# EAGLE schematic SignControlSchematic_v0 (EAGLE 7.5.0)
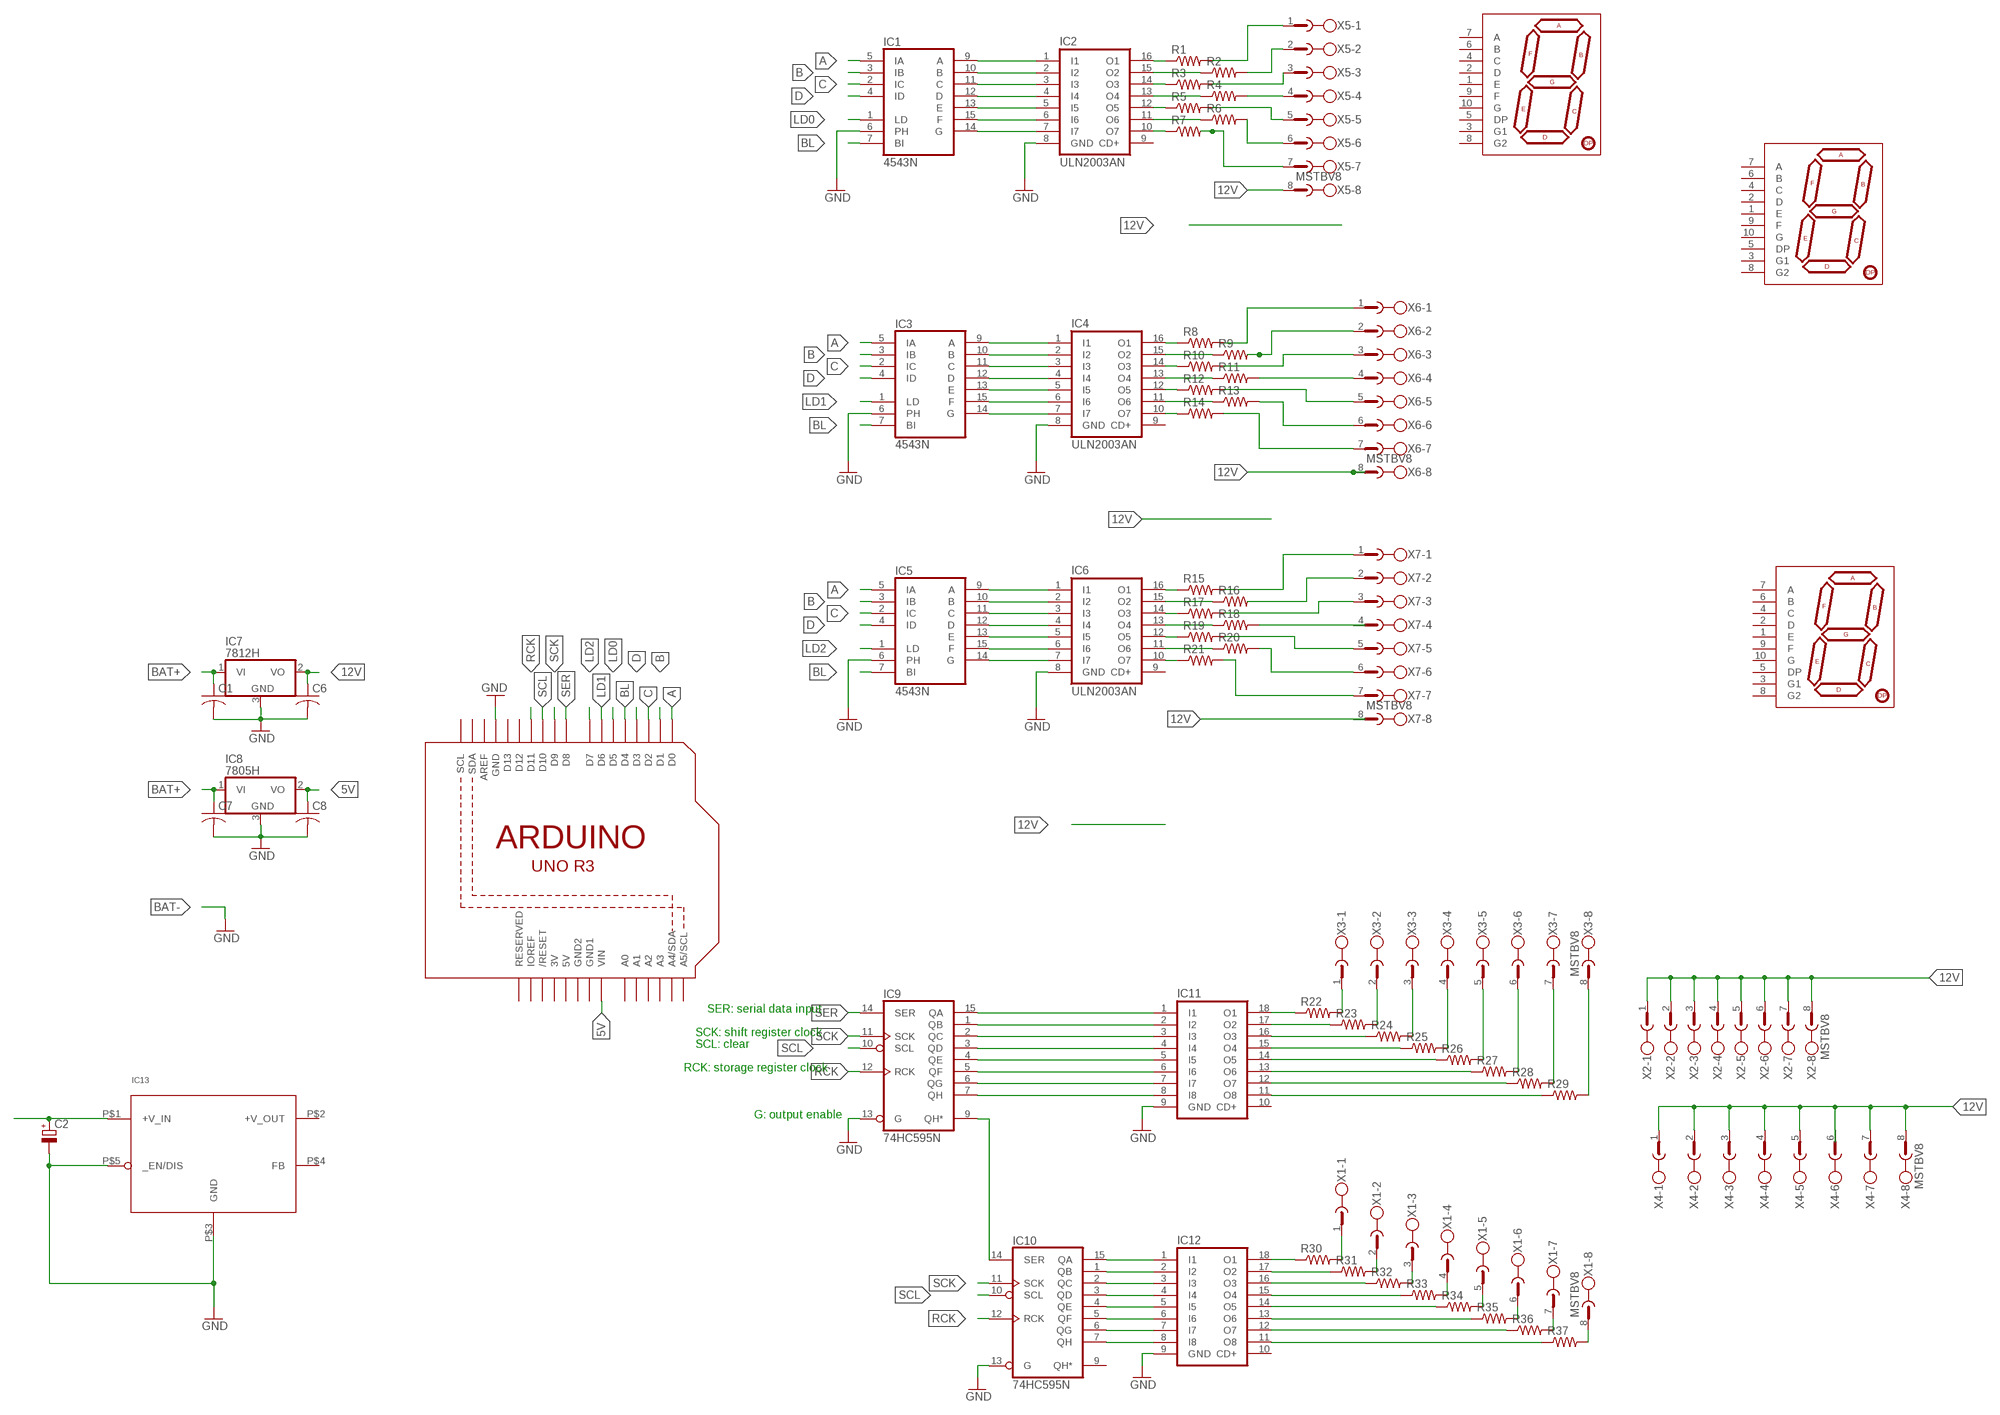
[diagram p0: schematic, sheet 1]

## Parts
C1  C-US025-024X044  [C025-024X044]
C2  CPOL-EUE7.5-16  [E7,5-16]
C6  C-US025-024X044  [C025-024X044]
C7  C-US025-024X044  [C025-024X044]
C8  C-US025-024X044  [C025-024X044]
IC1  4543N  [DIL16]
IC2  ULN2003AN  [DIL16]
IC3  4543N  [DIL16]
IC4  ULN2003AN  [DIL16]
IC5  4543N  [DIL16]
IC6  ULN2003AN  [DIL16]
IC7  7812H  [TO39]
IC8  7805H  [TO39]
IC9  74HC595N  [DIL16]
IC10  74HC595N  [DIL16]
IC11  ULN2803A  [DIL18]
IC12  ULN2803A  [DIL18]
IC13  LM2576-T05A  [TO-220-5_IN-LINE]
R1  R-US_0204/2V  [0204V]
R2  R-US_0204/2V  [0204V]
R3  R-US_0204/2V  [0204V]
R4  R-US_0204/2V  [0204V]
R5  R-US_0204/2V  [0204V]
R6  R-US_0204/2V  [0204V]
R7  R-US_0204/2V  [0204V]
R8  R-US_0204/2V  [0204V]
R9  R-US_0204/2V  [0204V]
R10  R-US_0204/2V  [0204V]
R11  R-US_0204/2V  [0204V]
R12  R-US_0204/2V  [0204V]
R13  R-US_0204/2V  [0204V]
R14  R-US_0204/2V  [0204V]
R15  R-US_0204/2V  [0204V]
R16  R-US_0204/2V  [0204V]
R17  R-US_0204/2V  [0204V]
R18  R-US_0204/2V  [0204V]
R19  R-US_0204/2V  [0204V]
R20  R-US_0204/2V  [0204V]
R21  R-US_0204/2V  [0204V]
R22  R-US_0204/2V  [0204V]
R23  R-US_0204/2V  [0204V]
R24  R-US_0204/2V  [0204V]
R25  R-US_0204/2V  [0204V]
R26  R-US_0204/2V  [0204V]
R27  R-US_0204/2V  [0204V]
R28  R-US_0204/2V  [0204V]
R29  R-US_0204/2V  [0204V]
R30  R-US_0204/2V  [0204V]
R31  R-US_0204/2V  [0204V]
R32  R-US_0204/2V  [0204V]
R33  R-US_0204/2V  [0204V]
R34  R-US_0204/2V  [0204V]
R35  R-US_0204/2V  [0204V]
R36  R-US_0204/2V  [0204V]
R37  R-US_0204/2V  [0204V]
U1  ARDUINOR3-BPLACE  [ARDUINOR3-BPLACE]
U$1  7-SEGMENT-DISPLAY-1"-RED  [7-SEGMENT-1"PTH]
U$2  7-SEGMENT-DISPLAY-1"-RED  [7-SEGMENT-1"PTH]
U$3  7-SEGMENT-DISPLAY-1"-RED  [7-SEGMENT-1"PTH]
X1  MSTBV8  [MSTBV8]
X2  MSTBV8  [MSTBV8]
X3  MSTBV8  [MSTBV8]
X4  MSTBV8  [MSTBV8]
X5  MSTBV8  [MSTBV8]
X6  MSTBV8  [MSTBV8]
X7  MSTBV8  [MSTBV8]

## Nets
5V: C8.1 IC8.2(VO) U1.VIN
12V: C6.1 IC7.2(VO) X2.1 X2.2 X2.3 X2.4 X2.5 X2.6 X2.7 X2.8 X4.1 X4.2 X4.3 X4.4 X4.5 X4.7 X4.8 X5.8 X6.8
A: IC1.5(IA) IC3.5(IA) IC5.5(IA) U1.D0
B: IC1.3(IB) IC3.3(IB) IC5.3(IB) U1.D1
BAT+: C1.1 C7.1 IC7.1(VI) IC8.1(VI)
BL: IC1.7(BI) IC3.7(BI) IC5.7(BI) U1.D4
C: IC1.2(IC) IC3.2(IC) IC5.2(IC) U1.D2
D: IC1.4(ID) IC3.4(ID) IC5.4(ID) U1.D3
GND: C1.2 C2.- C6.2 C7.2 C8.2 IC1.6(PH) IC2.8(GND) IC3.6(PH) IC4.8(GND) IC5.6(PH) IC6.8(GND) IC7.3(GND) IC8.3(GND) IC9.13(G) IC10.13(G) IC11.9(GND) IC12.9(GND) IC13.P$3(GND) IC13.P$5(_EN/DIS) U1.GND
LD0: IC1.1(LD) U1.D5
LD1: IC3.1(LD) U1.D6
LD2: IC5.1(LD) U1.D7
N$1: IC1.9(A) IC2.1(I1)
N$2: IC2.16(O1) R1.1
N$3: IC1.10(B) IC2.2(I2)
N$4: R1.2 X5.1
N$5: IC1.11(C) IC2.3(I3)
N$6: IC2.15(O2) R2.1
N$7: IC1.12(D) IC2.4(I4)
N$8: R2.2 X5.2
N$9: IC1.13(E) IC2.5(I5)
N$10: IC2.14(O3) R3.1
N$11: IC1.15(F) IC2.6(I6)
N$12: IC1.14(G) IC2.7(I7)
N$13: R3.2 X5.3
N$14: R4.2 X5.4
N$15: IC3.9(A) IC4.1(I1)
N$16: IC2.13(O4) R4.1
N$17: IC3.10(B) IC4.2(I2)
N$18: IC2.12(O5) R5.1
N$19: IC3.11(C) IC4.3(I3)
N$20: R5.2 X5.5
N$21: IC3.12(D) IC4.4(I4)
N$22: R6.2 X5.6
N$23: IC3.13(E) IC4.5(I5)
N$24: IC2.11(O6) R6.1
N$25: IC3.15(F) IC4.6(I6)
N$26: IC3.14(G) IC4.7(I7)
N$27: IC2.10(O7) R7.1
N$28: R7.2 X5.7
N$29: IC5.9(A) IC6.1(I1)
N$30: IC4.16(O1) R8.1
N$31: IC5.10(B) IC6.2(I2)
N$32: R8.2 X6.1
N$33: IC5.11(C) IC6.3(I3)
N$34: R9.2 X6.2
N$35: IC5.12(D) IC6.4(I4)
N$36: IC4.15(O2) R9.1
N$37: IC5.13(E) IC6.5(I5)
N$38: IC4.14(O3) R10.1
N$39: IC5.15(F) IC6.6(I6)
N$40: IC5.14(G) IC6.7(I7)
N$41: R10.2 X6.3
N$42: R11.2 X6.4
N$43: IC4.13(O4) R11.1
N$44: IC4.12(O5) R12.1
N$45: R12.2 X6.5
N$46: R13.2 X6.6
N$47: IC4.11(O6) R13.1
N$48: IC4.10(O7) R14.1
N$49: R14.2 X6.7
N$50: IC6.16(O1) R15.1
N$51: R15.2 X7.1
N$52: X7.2
N$53: IC6.15(O2) R16.1
N$54: IC6.14(O3) R17.1
N$55: R17.2 X7.3
N$56: R18.2
N$57: IC6.13(O4) R18.1
N$58: IC6.12(O5) R19.1
N$59: R19.2 X7.5
N$60: R20.2 X7.6
N$61: IC6.11(O6) R20.1
N$62: IC6.10(O7) R21.1
N$63: R21.2 X7.7
N$64: R22.2 X3.1
N$65: R23.2 X3.2
N$66: R24.2 X3.3
N$67: R25.2 X3.4
N$68: R26.2 X3.5
N$69: R27.2 X3.6
N$70: R28.2 X3.7
N$71: R29.2 X3.8
N$72: R30.2 X1.1
N$73: R31.2 X1.2
N$74: R32.2 X1.3
N$75: R33.2 X1.4
N$76: R34.2 X1.5
N$77: R35.2 X1.6
N$78: R36.2 X1.7
N$79: R37.2 X1.8
N$80: IC11.18(O1) R22.1
N$81: IC11.17(O2) R23.1
N$82: IC11.16(O3) R24.1
N$83: IC11.15(O4) R25.1
N$84: IC11.14(O5) R26.1
N$85: IC11.13(O6) R27.1
N$86: IC11.12(O7) R28.1
N$87: IC11.11(O8) R29.1
N$88: IC12.18(O1) R30.1
N$89: IC12.17(O2) R31.1
N$90: IC12.16(O3) R32.1
N$91: IC12.15(O4) R33.1
N$92: IC12.14(O5) R34.1
N$93: IC12.13(O6) R35.1
N$94: IC12.12(O7) R36.1
N$95: IC12.11(O8) R37.1
N$96: IC9.9(QH*) IC10.14(SER)
N$97: IC9.15(QA) IC11.1(I1)
N$98: IC9.1(QB) IC11.2(I2)
N$99: IC9.2(QC) IC11.3(I3)
N$100: IC9.3(QD) IC11.4(I4)
N$101: IC9.4(QE) IC11.5(I5)
N$102: IC9.5(QF) IC11.6(I6)
N$103: IC9.6(QG) IC11.7(I7)
N$104: IC9.7(QH) IC11.8(I8)
N$105: IC10.15(QA) IC12.1(I1)
N$106: IC10.1(QB) IC12.2(I2)
N$107: IC10.2(QC) IC12.3(I3)
N$108: IC10.3(QD) IC12.4(I4)
N$109: IC10.4(QE) IC12.5(I5)
N$110: IC10.5(QF) IC12.6(I6)
N$111: IC10.6(QG) IC12.7(I7)
N$112: IC10.7(QH) IC12.8(I8)
N$113: C2.+ IC13.P$1(+V_IN)
RCK: IC9.12(RCK) IC10.12(RCK) U1.D11
SCK: IC9.11(SCK) IC10.11(SCK) U1.D9
SCL: IC9.10(SCL) IC10.10(SCL) U1.D10
SER: IC9.14(SER) U1.D8
Unconnected: IC2.9(CD+) IC4.9(CD+) IC6.9(CD+) IC10.9(QH*) IC11.10(CD+) IC12.10(CD+) IC13.P$2(+V_OUT) IC13.P$4(FB) R16.2 U1.A0 U1.A1 U1.A2 U1.A3 U1.A4(A4/SDA) U1.A5(A5/SCL) U1.AREF U1.D12 U1.D13 U1.IOREF U1.RESERVED U1.RESET(/RESET) U1.SCL U1.SDA U$1.1(E) U$1.2(D) U$1.3(G1) U$1.4(C) U$1.5(DP) U$1.6(B) U$1.7(A) U$1.8(G2) U$1.9(F) U$1.10(G) U$2.1(E) U$2.2(D) U$2.3(G1) U$2.4(C) U$2.5(DP) U$2.6(B) U$2.7(A) U$2.8(G2) U$2.9(F) U$2.10(G) U$3.1(E) U$3.2(D) U$3.3(G1) U$3.4(C) U$3.5(DP) U$3.6(B) U$3.7(A) U$3.8(G2) U$3.9(F) U$3.10(G) X4.6 X7.4 X7.8

## Notes on the sheet
- SER: serial data input
- SCK: shift register clock
- SCL: clear
- RCK: storage register clock
- G: output enable

## Power pins joined to a net without a drawn wire
3V: U1.3V
5V: U1.5V
GND: IC9.8(GND) IC10.8(GND)
GND1: U1.GND1
GND2: U1.GND2
VCC: IC9.16(VCC) IC10.16(VCC)
VDD: IC1.16(VDD) IC3.16(VDD) IC5.16(VDD)
VSS: IC1.8(VSS) IC3.8(VSS) IC5.8(VSS)

## Library data of the parts
C1 C6-C8 = adafruit:C-US: CAPACITOR, American symbol
C2 = resistor:CPOL-EU: POLARIZED CAPACITOR, European symbol
IC1 IC3 IC5 = 45xx:4543: BCD to 7-segment LCD DECODER
IC2 IC4 IC6 = uln-udn:ULN2003A: DRIVER ARRAY
IC7 IC8 = adafruit:78*: Positive VOLTAGE REGULATOR Added bigger pads to the TO-92 package
IC9 IC10 = 74xx-eu:74*595: 8-bit SHIFT REGISTER, output latch
IC11 IC12 = uln-udn:ULN2803A: DRIVER ARRAY
IC13 = to220-custom:LM2576-T05A: LM2576/LM2576HV Series SIMPLE SWITCHER® 3A Step-Down Voltage Regulator IN-LINE PACKAGE
R1-R37 = adafruit:R-US_: RESISTOR, American symbol
U1 = adafruit:ARDUINOR3: This is a new object for the new Arduino R3 - with extra pins that you may want to use (such as IOref, and duplicated A4/A5
U$1-U$3 = SparkFun-Displays:7-SEGMENT-DISPLAY-1"-RED: 7-Segment Display 1" Red (COM-08546) EZ is for kits. Pads are only exposed on the bottom side to help prevent soldering in upside down.
X1-X7 = con-phoenix-508:MSTBV8: PHOENIX; MPN: MSTBV 2,5/8-GF-5.08; OC_FARNELL: 1792797; OC_NEWARK: 69R9850